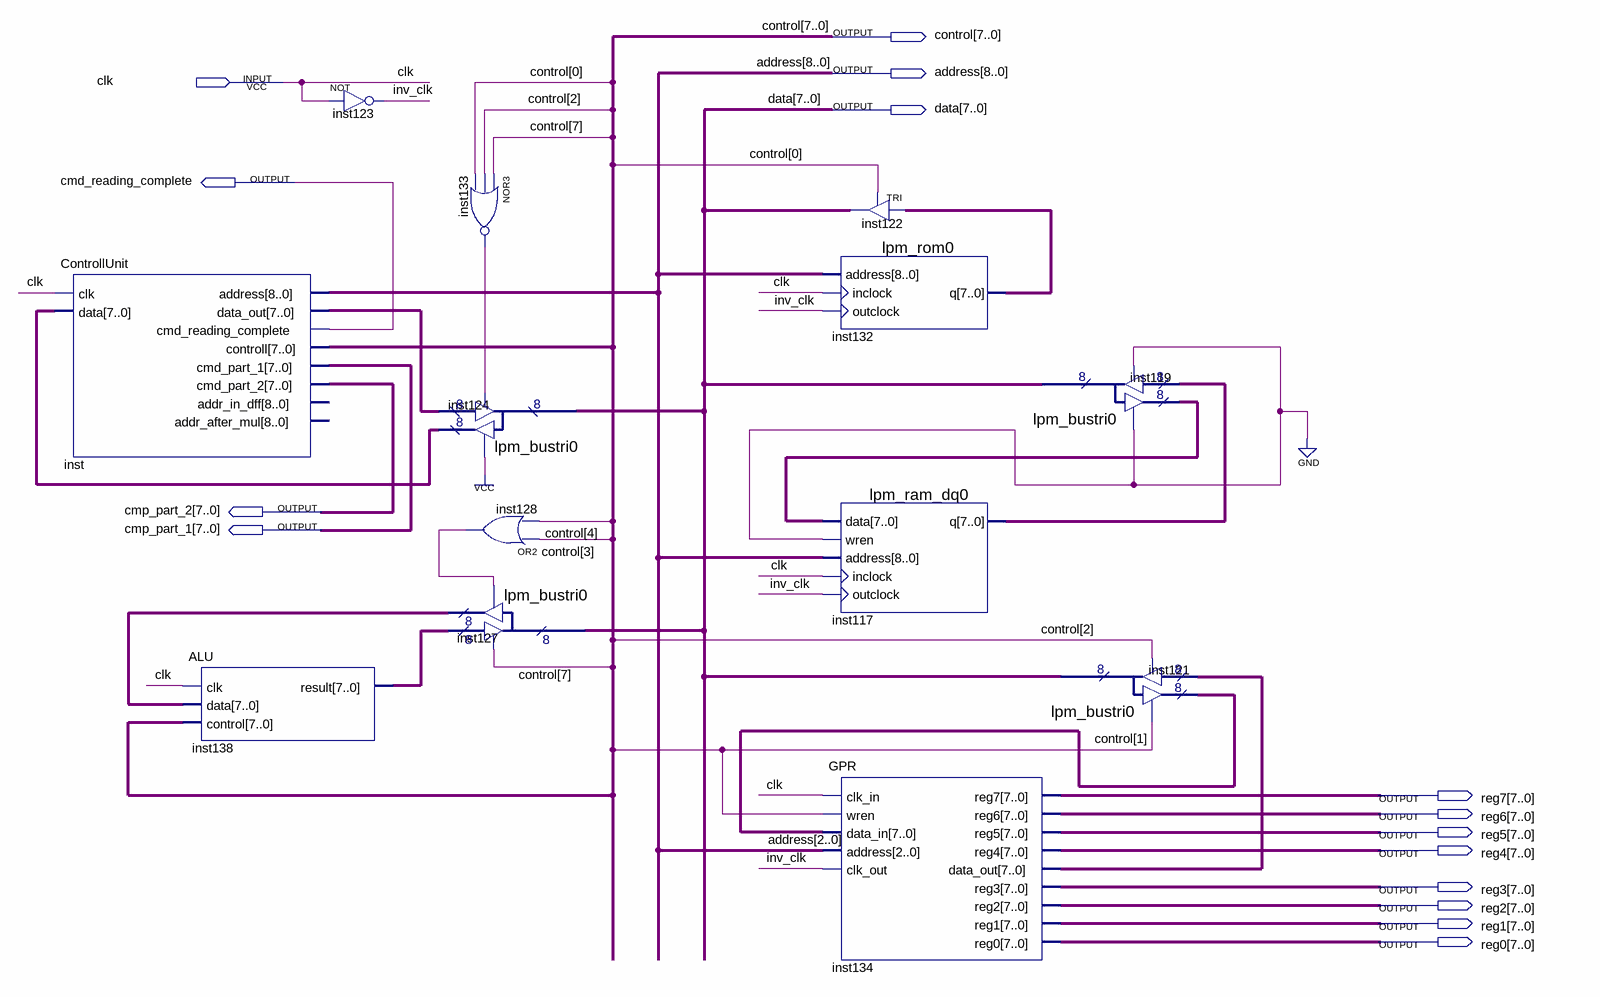
[diagram p0: schematic sheet]
// Quartus schematic LightPU.bdf as structural Verilog: 13 symbols, 15 pins
module LightPU (
  input  clk,
  output [7:0] control,
  output [8:0] address,
  output [7:0] data,
  output cmd_reading_complete,
  output [7:0] cmp_part_2,
  output [7:0] cmp_part_1,
  output [7:0] reg7,
  output [7:0] reg6,
  output [7:0] reg5,
  output [7:0] reg4,
  output [7:0] reg3,
  output [7:0] reg2,
  output [7:0] reg1,
  output [7:0] reg0
);

  wire inst128_out, inst133_out, inv_clk;
  wire [7:0] inst117_q, inst119_result, inst121_result, inst124_result, inst127_result, inst132_q,
       inst134_data_out, inst138_result, inst_data_out;

  ControllUnit inst (
    .clk(clk), .data(inst124_result), .address(address), .data_out(inst_data_out),
    .cmd_reading_complete(cmd_reading_complete), .controll(control), .cmd_part_1(cmp_part_1),
    .cmd_part_2(cmp_part_2));  // open: addr_in_dff, addr_after_mul
  ALU inst138 (.clk(clk), .data(inst127_result), .control(control), .result(inst138_result));
  not inst123 (inv_clk, clk);
  nor inst133 (inst133_out, control[7], control[2], control[0]);
  lpm_bustri0 inst124 (
    .enabledt(inst133_out), .data(inst_data_out), .enabletr(1'b1), .result(inst124_result), .tridata(data));
  or inst128 (inst128_out, control[3], control[4]);
  lpm_bustri0 inst127 (
    .enabledt(control[7]), .data(inst138_result), .enabletr(inst128_out), .result(inst127_result),
    .tridata(data));
  TRI inst122[7:0] (.IN(inst132_q), .OE(control[0]), .OUT(data));
  lpm_rom0 inst132 (.address(address), .inclock(clk), .outclock(inv_clk), .q(inst132_q));
  lpm_ram_dq0 inst117 (
    .data(inst119_result), .wren(1'b0), .address(address), .inclock(clk), .outclock(inv_clk), .q(inst117_q));
  GPR inst134 (
    .clk_in(clk), .wren(control[1]), .data_in(inst121_result), .address(address[2:0]), .clk_out(inv_clk),
    .reg7(reg7), .reg6(reg6), .reg5(reg5), .reg4(reg4), .data_out(inst134_data_out), .reg3(reg3),
    .reg2(reg2), .reg1(reg1), .reg0(reg0));
  lpm_bustri0 inst119 (.enabledt(1'b0), .data(inst117_q), .enabletr(1'b0), .result(inst119_result), .tridata(data));
  lpm_bustri0 inst121 (
    .enabledt(control[2]), .data(inst134_data_out), .enabletr(control[1]), .result(inst121_result),
    .tridata(data));
endmodule
